# EAGLE design Arduino_S3v3_R2 (EAGLE 9.6.2)
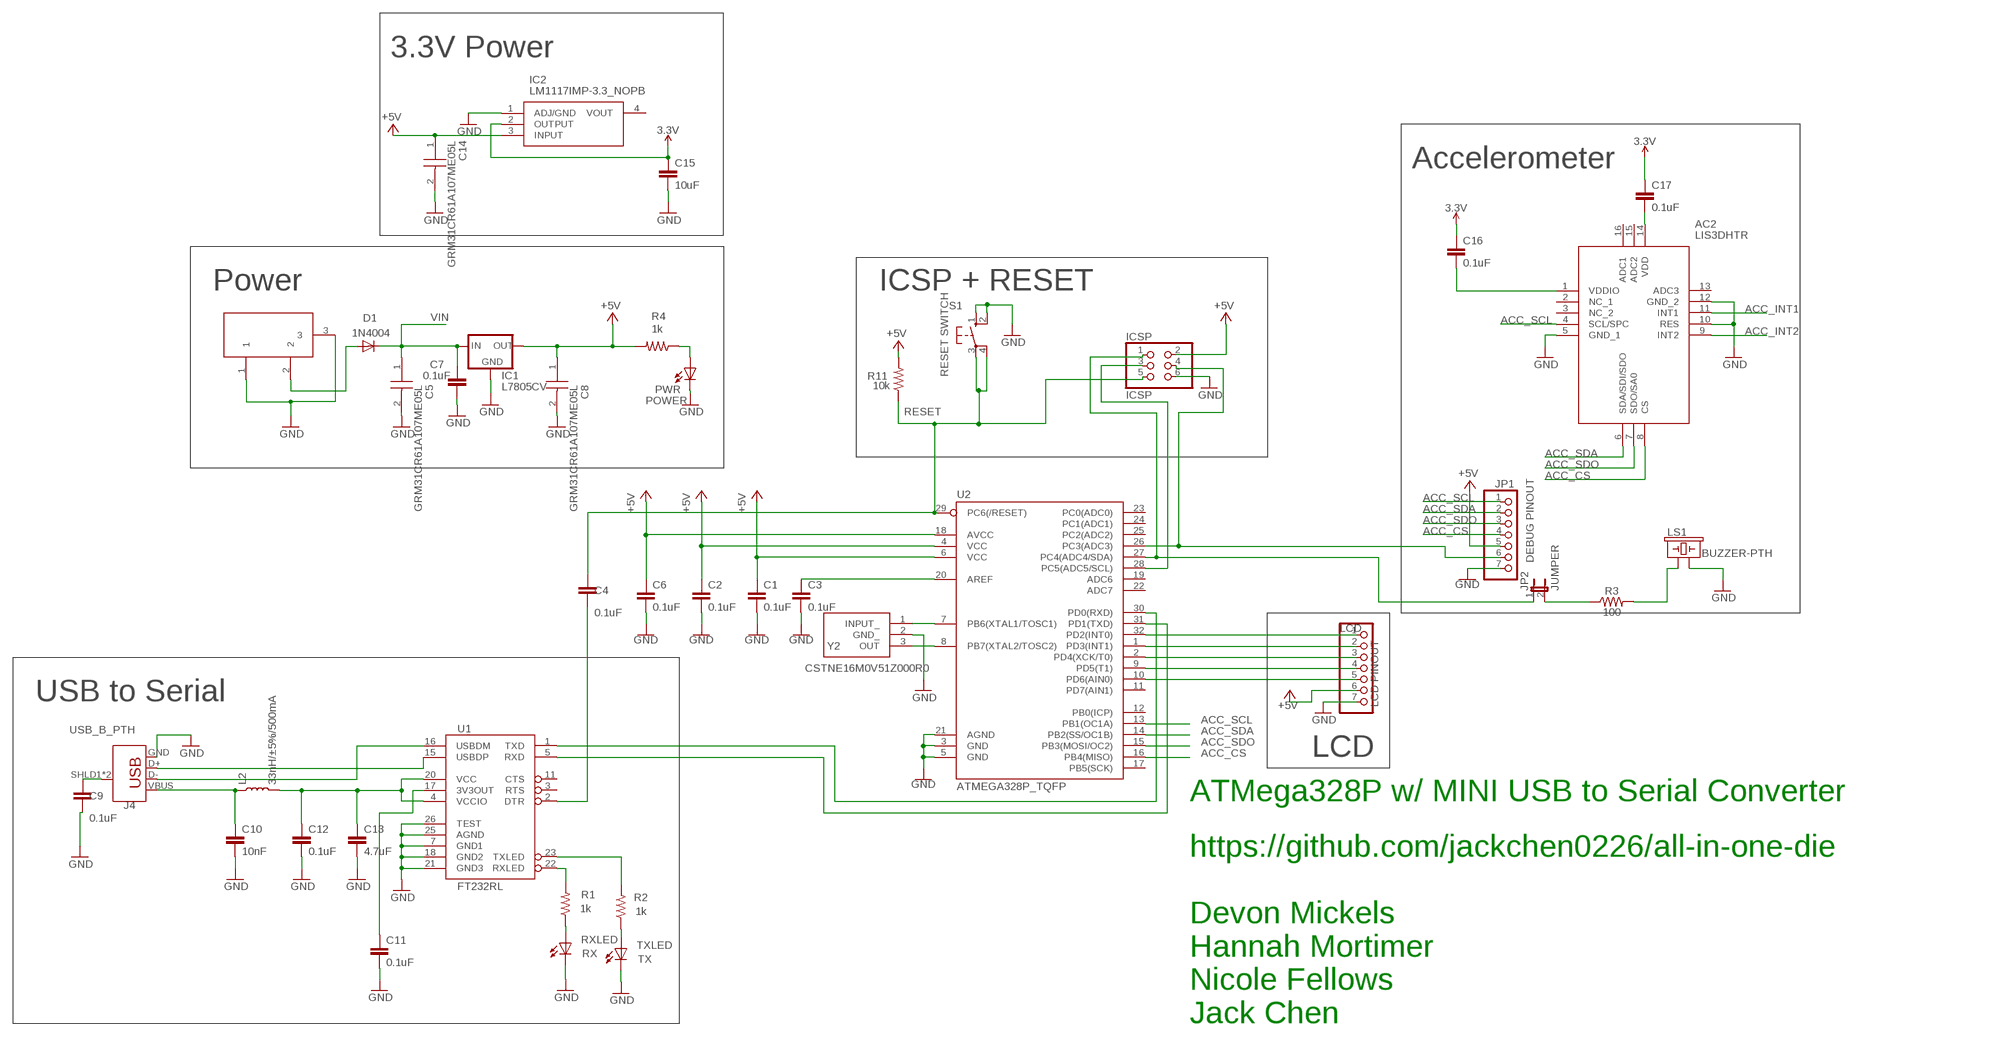
[diagram p0: schematic, sheet 1]

## Parts
AC2  LIS3DHTR  [LIS3DHTR]
C1  0.1uF  0.1UF-0603-25V-(+80/-20%)  [0603]
C2  0.1uF  0.1UF-0603-25V-(+80/-20%)  [0603]
C3  0.1uF  0.1UF-0603-25V-(+80/-20%)  [0603]
C4  0.1uF  0.1UF-0603-25V-(+80/-20%)  [0603]
C5  GRM31CR61A107ME05L  [CAPC3216X180N]
C6  0.1uF  0.1UF-0603-25V-(+80/-20%)  [0603]
C7  0.1uF  0.1UF-0603-25V-(+80/-20%)  [0603]
C8  GRM31CR61A107ME05L  [CAPC3216X180N]
C9  0.1uF  0.1UF-0603-25V-(+80/-20%)  [0603]
C10  10nF  10NF-0603-50V-10%  [0603]
C11  0.1uF  0.1UF-0603-25V-(+80/-20%)  [0603]
C12  0.1uF  0.1UF-0603-25V-(+80/-20%)  [0603]
C13  4.7uF  4.7UF0603  [0603]
C14  GRM31CR61A107ME05L  [CAPC3216X180N]
C15  10uF  10UF-0603-6.3V-20%  [0603]
C16  0.1uF  0.1UF-0603-25V-(+80/-20%)  [0603]
C17  0.1uF  0.1UF-0603-25V-(+80/-20%)  [0603]
D1  1N4004  [DO41-10]
DC1  DC21MMX  [DC-21MM]
IC1  L7805CV  78XXS  [78XXS]
IC2  LM1117IMP-3.3_NOPB  [SOT230P700X180-4N]
ICSP  ICSP  PINHD-2X3  [2X03]
J4  USB_B_PTH  [USB-B-PTH]
JP1  DEBUG PINOUT  PINHD-1X7  [1X07]
JP2  JUMPER  JP1E  [JP1]
L2  33nH/±5%/500mA  INDUCTOR-0603-33NH  [0603]
LCD  LCD PINOUT  PINHD-1X7  [1X07]
LS1  BUZZER-PTH  [BUZZER-12MM]
PWR  POWER  LED3MM  [LED3MM]
R1  1k  1KOHM-0603-1/10W-1%  [0603]
R2  1k  1KOHM-0603-1/10W-1%  [0603]
R3  100  100OHM-0603-1/4W-5%  [0603]
R4  1k  1KOHM-0603-1/10W-1%  [0603]
R11  10k  10KOHM-0603-1/10W-1%  [0603]
RXLED  RX  LED3MM  [LED3MM]
S1  RESET SWITCH  10-XX  [B3F-10XX]
TXLED  TX  LED3MM  [LED3MM]
U1  FT232RL  FT232RL-BASICSSOP  [SSOP28DB]
U2  ATMEGA328P_TQFP  [TQFP32-08]
Y2  CSTNE16M0V51Z000R0  [CSTNE16M0V51Z000R0]

## Nets
3.3V: C15.1 C16.1 C17.1 IC2.2(OUTPUT)
+5V [power]: C1.1 C2.1 C6.1 C8.1 C14.1 IC1.OUT IC2.3(INPUT) ICSP.2 JP1.5 LCD.6 R4.2 R11.2 U2.4(VCC) U2.6(VCC) U2.18(AVCC)
ACC_CS: AC2.8(CS) JP1.4 U2.16(PB4(MISO))
ACC_INT1: AC2.11(INT1)
ACC_INT2: AC2.9(INT2)
ACC_SCL: AC2.4(SCL/SPC) JP1.1 U2.13(PB1(OC1A))
ACC_SDA: AC2.6(SDA/SDI/SDO) JP1.2 U2.14(PB2(SS/OC1B))
ACC_SDO: AC2.7(SDO/SA0) JP1.3 U2.15(PB3(MOSI/OC2))
BUZZ: ICSP.1 JP2.1 U2.27(PC4(ADC4/SDA))
GND: AC2.5(GND_1) AC2.10(RES) AC2.12(GND_2) C1.2 C2.2 C3.2 C5.2 C6.2 C7.1 C8.2 C9.2 C10.2 C11.2 C12.2 C13.2 C14.2 C15.2 DC1.1 DC1.3 IC1.GND IC2.1(ADJ/GND) ICSP.6 J4.GND JP1.7 LCD.7 LS1.- PWR.K(C) RXLED.K(C) S1.1(S) S1.2(S1) TXLED.K(C) U1.7(GND1) U1.18(GND2) U1.21(GND3) U1.25(AGND) U1.26(TEST) U2.3(GND) U2.5(GND) U2.21(AGND) Y2.2(GND_)
LCD_CS: LCD.1 U2.32(PD2(INT0))
LCD_SCL: LCD.4 U2.9(PD5(T1))
LCD_SDA: LCD.3 U2.2(PD4(XCK/T0))
LCD_SDO: LCD.2 U2.1(PD3(INT1))
N$1: U2.7(PB6(XTAL1/TOSC1)) Y2.1(INPUT_)
N$2: C9.1 J4.SHLD1(SHIELD) J4.SHLD2(SHIELD)
N$3: PWR.A R4.1
N$4: C4.2 U1.2(DTR)
N$5: AC2.14(VDD) C17.2
N$6: U2.8(PB7(XTAL2/TOSC2)) Y2.3(OUT)
N$7: AC2.1(VDDIO) C16.2
N$8: D1.A DC1.2
N$9: J4.D+ U1.15(USBDP)
N$11: LCD.5 U2.10(PD6(AIN0))
N$12: JP2.2 R3.1
N$14: LS1.+ R3.2
N$15: ICSP.3 U2.28(PC5(ADC5/SCL))
N$16: C3.1 U2.20(AREF)
N$17: C11.1 U1.17(3V3OUT)
N$24: J4.D- U1.16(USBDM)
N$30: C10.1 J4.VBUS L2.1
N$32: R2.1 TXLED.A
N$33: R1.1 RXLED.A
POTIN: ICSP.4 JP1.6 U2.26(PC3(ADC3))
RESET: C4.1 ICSP.5 R11.1 S1.3(P) S1.4(P1) U2.29(PC6(/RESET))
RXD: U1.5(RXD) U2.31(PD1(TXD))
RXLED: R1.2 U1.22(RXLED)
TXD: U1.1(TXD) U2.30(PD0(RXD))
TXLED: R2.2 U1.23(TXLED)
VBUS: C12.1 C13.1 L2.2 U1.4(VCCIO) U1.20(VCC)
VIN [power]: C5.1 C7.2 D1.C IC1.IN
Unconnected: AC2.2(NC_1) AC2.3(NC_2) AC2.13(ADC3) AC2.15(ADC2) AC2.16(ADC1) IC2.4(VOUT) U1.3(RTS) U1.11(CTS) U2.11(PD7(AIN1)) U2.12(PB0(ICP)) U2.17(PB5(SCK)) U2.19(ADC6) U2.22(ADC7) U2.23(PC0(ADC0)) U2.24(PC1(ADC1)) U2.25(PC2(ADC2))

## Notes on the sheet
- 3.3V Power
- Accelerometer
- Power | ICSP + RESET
- USB to Serial
- LCD
- ATMega328P w/ MINI USB to Serial Converter
- https://github.com/jackchen0226/all-in-one-die
  
  Devon Mickels
  Hannah Mortimer
  Nicole Fellows
  Jack Chen

## Library data of the parts
AC2 = SamacSys_Parts:LIS3DHTR: Accelerometer 3-Axis 2g/16g 1.8V LGA16 STMicroelectronics LIS3DHTR Accelerometer IC, 3-axis, I2C, SPI 1.71 3.6 V, 16-Pin LGA Source: Datasheet <http://www.st.com/content/ccc/resource/technical/document/datasheet/3c/ae/50/85/d6/b1/46/fe/CD00274221.pdf/files/CD00274221.pdf/jcr:content/translations/en.CD00274221.pdf>; DESCRIPTION: Accelerometer 3-Axis 2g/16g 1.8V LGA16 STMicroelectronics LIS3DHTR Accelerometer IC, 3-axis, I2C, SPI 1.71 3.6 V, 16-Pin LGA; HEIGHT: 1mm; MANUFACTURER_NAME: STMicroelectronics; MANUFACTURER_PART_NUMBER: LIS3DHTR; MOUSER_PART_NUMBER: 511-LIS3DHTR; MOUSER_PRICE-STOCK: https://www.mouser.co.uk/ProductDetail/STMicroelectronics/LIS3DHTR?qs=6la6oa3D8xzhXYax3cEo4w%3D%3D
C1-C4 C6 C7 C9 C11 C12 C16 C17 = SparkFun-Capacitors:0.1UF: 0.1µF ceramic capacitors A capacitor is a passive two-terminal electrical component used to store electrical energy temporarily in an electric field.; MFR: KEMET; MPN: C0603X104K5RAC3316; PROD_ID: CAP-00810
C5 C8 C14 = SamacSys_Parts:GRM31CR61A107ME05L: Multilayer Ceramic Capacitors MLCC - SMD/SMT 100UF 10V 20% 1206 Source: Datasheet <https://psearch.en.murata.com/capacitor/product/GRM31CR61A107ME05#.html>; DESCRIPTION: Multilayer Ceramic Capacitors MLCC - SMD/SMT 100UF 10V 20% 1206; HEIGHT: 1.8mm; MANUFACTURER_NAME: Murata Electronics; MANUFACTURER_PART_NUMBER: GRM31CR61A107ME05L; MOUSER_PART_NUMBER: 81-GRM31CR61A107ME5L; MOUSER_PRICE-STOCK: https://www.mouser.co.uk/ProductDetail/Murata-Electronics/GRM31CR61A107ME05L?qs=chTDxNqvsylSo93CzdbYkQ%3D%3D
C10 = SparkFun-Capacitors:10NF: 0.01uF/10nF/10,000pF ceramic capacitors A capacitor is a passive two-terminal electrical component used to store electrical energy temporarily in an electric field. CAP-09321; MFR: KEMET; MPN: C0603C103K5RAC7013; PROD_ID: CAP-00867
C13 = SparkFun-Capacitors:4.7UF: 4.7µF ceramic capacitors A capacitor is a passive two-terminal electrical component used to store electrical energy temporarily in an electric field.; MFR: Taiyo Yuden; MPN: LMK107BJ475MAHT; PROD_ID: CAP-08280
C15 = SparkFun-Capacitors:10UF: 10.0µF ceramic capacitors A capacitor is a passive two-terminal electrical component used to store electrical energy temporarily in an electric field.; MFR: Murata Electronics; MOUSER_URL: https://www.mouser.com/ProductDetail/Murata-Electronics/GRM188R61E106KA73D?qs=sGAEpiMZZMsh%252B1woXyUXj%252BPOAS4JE4Y%252Bzpwpuo4MIOw%3D; MPN: GRM188R61E106KA73D; PROD_ID: CAP-11015
D1 = diode:1N4004: DIODE general purpose rectifier, 1 A; MFR: Diodes Incorporated; MPN: 1N4004-T
DC1 = powersupply:DC21MM; MFR: Gravitech; MPN: CON-SOCJ-2155
IC1 = v-reg:78XXS: VOLTAGE REGULATOR; MFR: STMicroelectronics; MPN: L7805CV
IC2 = SamacSys_Parts:LM1117IMP-3.3_NOPB: LM1117IMP-3.3/NOPB, Low Dropout Voltage Regulator, 1.5A, 3.3 V +/-1%, 4-Pin SOT-223 Source: Datasheet <http://www.ti.com/general/docs/suppproductinfo.tsp?distId=10&gotoUrl=http://www.ti.com/lit/gpn/lm1117>; DESCRIPTION: LM1117IMP-3.3/NOPB, Low Dropout Voltage Regulator, 1.5A, 3.3 V +/-1%, 4-Pin SOT-223; HEIGHT: 1.8mm; MANUFACTURER_NAME: Texas Instruments; MANUFACTURER_PART_NUMBER: LM1117IMP-3.3/NOPB; MOUSER_PART_NUMBER: 926-LM1117IMP3.3NOPB; MOUSER_PRICE-STOCK: https://www.mouser.co.uk/ProductDetail/Texas-Instruments/LM1117IMP-33-NOPB?qs=X1J7HmVL2ZFbpN1TgOsjYQ%3D%3D
ICSP = pinhead:PINHD-2X3: PIN HEADER; MFR: Harwin; MOUSER_URL: https://www.mouser.com/ProductDetail/Harwin/M20-9980346?qs=%2Fha2pyFadugpDTU623Z7cOn94IPgrKYxpsSsFXjhjuIUvhMLOEYbRg%3D%3D; MPN: M20-9980346
J4 = SparkFun-Connectors:USB_B: USB Type B Connector SparkFun Products: SparkFun Stepoko <https://www.sparkfun.com/products/13899> PTH; MFR: Amphenol FCI; MPN: 61729-0010BLF; PROD_ID: CONN-08278; SF_ID: PRT-00139
JP1 LCD = pinhead:PINHD-1X7: PIN HEADER; MFR: Harwin; MOUSER_URL: https://www.mouser.com/ProductDetail/Harwin/M20-9770746?qs=Jph8NoUxIfW4IDi91nhySw%3D%3D; MPN: M20-9770746
JP2 = jumper:JP1E: JUMPER; MFR: Harwin; MOUSER_URL: https://www.mouser.com/ProductDetail/Harwin/M20-9990246?qs=%2Fha2pyFaduiXJxN7aDGirbxqdyhVq5pmtKpTydx04Ewn6SNnO8w53Q%3D%3D; MPN: M20-9990246
L2 = SparkFun-Coils:INDUCTOR: Inductors Resist changes in electrical current. Basically a coil of wire. SparkFun Products: SparkFun Load Cell Amplifier - HX711 <https://www.sparkfun.com/products/13879> IOIO-OTG - V2.2 <https://www.sparkfun.com/products/13613>; MFR: Murata Electronics; MPN: LQW18AS33NJ0CD; PROD_ID: NDUC-07874
LS1 = SparkFun-Electromechanical:BUZZER: Buzzer Small round buzzers that operate around the audible 2kHz range. You can use these as speakers to create simple music or user interfaces. Variant Overview: PTH - Mini Speaker - PC Mount 12mm 2.048kHz <https://www.sparkfun.com/products/7950> PTH_KIT - Mini Speaker - PC Mount 12mm 2.048kHz <https://www.sparkfun.com/products/7950> KIT simplifies soldering by adding stop mask to one side of the pads. PTH_NO_SILK - Mini Speaker - PC Mount 12mm 2.048kHz <https://www.sparkfun.com/products/7950> No silkscreen indicator of buzzer outline. PTH_KIT_NO_SILK - Mini Speaker - PC Mount 12mm 2.048kHz <https://www.sparkfun.com/products/7950> KIT package w/o silkscreen SMD - Buzzer Audio Magnetic (CCV-084B16) SMD buzzer used on, e.g. the LilyPad Buzzer <https://www.sparkfun.com/products/8463> and RFID USB Reader <https://www.sparkfun.com/products/9963>. SMD_KIT - Buzzer Audio Magnetic (CCV-084B16) SMD Buzzer with elongated pins to make soldering easier. Used on the SparkFun Simon Says - Surface Mount Soldering Kit <https://www.sparkfun.com/products/10935>.; MFR: TDK; MPN: SD1209T5-A1; PROD_ID: COMP-08253; SF_SKU: COM-07950
PWR = led:LED: LED OSRAM: - CHIPLED LG R971, LG N971, LY N971, LG Q971, LY Q971, LO R971, LY R971 LH N974, LH R974 LS Q976, LO Q976, LY Q976 LO Q996 - Hyper CHIPLED LW Q18S LB Q993, LB Q99A, LB R99A - SideLED LS A670, LO A670, LY A670, LG A670, LP A670 LB A673, LV A673, LT A673, LW A673 LH A674 LY A675 LS A676, LA A676, LO A676, LY A676, LW A676 LS A679, LY A679, LG A679 - Hyper Micro SIDELED® LS Y876, LA Y876, LO Y876, LY Y876 LT Y87S - SmartLED LW L88C, LW L88S LB L89C, LB L89S, LG L890 LS L89K, LO L89K, LY L89K LS L896, LA L896, LO L896, LY L896 - TOPLED LS T670, LO T670, LY T670, LG T670, LP T670 LSG T670, LSP T670, LSY T670, LOP T670, LYG T670 LG T671, LOG T671, LSG T671 LB T673, LV T673, LT T673, LW T673 LH T674 LS T676, LA T676, LO T676, LY T676, LB T676, LH T676, LSB T676, LW T676 LB T67C, LV T67C, LT T67C, LS T67K, LO T67K, LY T67K, LW E67C LS E67B, LA E67B, LO E67B, LY E67B, LB E67C, LV E67C, LT E67C LW T67C LS T679, LY T679, LG T679 LS T770, LO T770, LY T770, LG T770, LP T770 LB T773, LV T773, LT T773, LW T773 LH T774 LS E675, LA E675, LY E675, LS T675 LS T776, LA T776, LO T776, LY T776, LB T776 LHGB T686 LT T68C, LB T68C - Hyper Mini TOPLED® LB M676 - Mini TOPLED Santana® LG M470 LS M47K, LO M47K, LY M47K Source: http://www.osram.convergy.de/; MFR: VCC; MPN: LTH3MM12VFR4100
R1 R2 R4 = SparkFun-Resistors:1KOHM: 1kΩ resistor A resistor is a passive two-terminal electrical component that implements electrical resistance as a circuit element. Resistors act to reduce current flow, and, at the same time, act to lower voltage levels within circuits. - Wikipedia; MFR: Vishay / Dale; MPN: RCC06031K00FKEA; PROD_ID: RES-07856
R3 = SparkFun-Resistors:100OHM: 100Ω resistor A resistor is a passive two-terminal electrical component that implements electrical resistance as a circuit element. Resistors act to reduce current flow, and, at the same time, act to lower voltage levels within circuits. - Wikipedia; MFR: Vishay / Dale; MOUSER_URL: https://www.mouser.com/ProductDetail/Vishay-Dale/RCC0603100RFKEA?qs=sGAEpiMZZMtlubZbdhIBINZyO39%252BOXIfMh0DS6XcVj8%3D; MPN: RCC0603100RFKEA; PROD_ID: RES-12438
R11 = SparkFun-Resistors:10KOHM: 10kΩ resistor A resistor is a passive two-terminal electrical component that implements electrical resistance as a circuit element. Resistors act to reduce current flow, and, at the same time, act to lower voltage levels within circuits. - Wikipedia; MFR: Panasonic; MPN: ERJ-UP3D1002V; PROD_ID: RES-00824
RXLED TXLED = led:LED: LED OSRAM: - CHIPLED LG R971, LG N971, LY N971, LG Q971, LY Q971, LO R971, LY R971 LH N974, LH R974 LS Q976, LO Q976, LY Q976 LO Q996 - Hyper CHIPLED LW Q18S LB Q993, LB Q99A, LB R99A - SideLED LS A670, LO A670, LY A670, LG A670, LP A670 LB A673, LV A673, LT A673, LW A673 LH A674 LY A675 LS A676, LA A676, LO A676, LY A676, LW A676 LS A679, LY A679, LG A679 - Hyper Micro SIDELED® LS Y876, LA Y876, LO Y876, LY Y876 LT Y87S - SmartLED LW L88C, LW L88S LB L89C, LB L89S, LG L890 LS L89K, LO L89K, LY L89K LS L896, LA L896, LO L896, LY L896 - TOPLED LS T670, LO T670, LY T670, LG T670, LP T670 LSG T670, LSP T670, LSY T670, LOP T670, LYG T670 LG T671, LOG T671, LSG T671 LB T673, LV T673, LT T673, LW T673 LH T674 LS T676, LA T676, LO T676, LY T676, LB T676, LH T676, LSB T676, LW T676 LB T67C, LV T67C, LT T67C, LS T67K, LO T67K, LY T67K, LW E67C LS E67B, LA E67B, LO E67B, LY E67B, LB E67C, LV E67C, LT E67C LW T67C LS T679, LY T679, LG T679 LS T770, LO T770, LY T770, LG T770, LP T770 LB T773, LV T773, LT T773, LW T773 LH T774 LS E675, LA E675, LY E675, LS T675 LS T776, LA T776, LO T776, LY T776, LB T776 LHGB T686 LT T68C, LB T68C - Hyper Mini TOPLED® LB M676 - Mini TOPLED Santana® LG M470 LS M47K, LO M47K, LY M47K Source: http://www.osram.convergy.de/; MFR: VCC; MPN: LTH3MM12VFR4500
S1 = switch-omron:10-XX: OMRON SWITCH; MFR: Omron Electronics; MPN: B3F-1000
U1 = SparkFun-IC-Comms:FT232RL-BASIC: FT232RL USB UART This is the simplified version of the FT232RL unit. Only what you need, nothing you don't. FT232RL 4th Generation USB UART (USB <-> Serial) Controller. Datasheet <http://www.sparkfun.com/datasheets/IC/FT232R_v104.pdf> SparkFun Products Component <https://www.sparkfun.com/products/650> (COM-00650) SparkFun RedBot Mainboard <https://www.sparkfun.com/products/12097> (ROB-12097) SparkFun FTDI Basic Breakout - 5V <https://www.sparkfun.com/products/9716> (DEV-09716) SparkFun FTDI Basic Breakout - 3.3V <https://www.sparkfun.com/products/9873> (DEV-09873) Bus Pirate - v3.6a <https://www.sparkfun.com/products/12942> (TOL-12942) SparkFun USB to Serial Breakout - FT232RL <https://www.sparkfun.com/products/12731> (BOB-12731) SparkFun PicoBoard <https://www.sparkfun.com/products/11888> (WIG-11888) SparkFun RFID USB Reader <https://www.sparkfun.com/products/9963> (SEN-09963) LilyPad FTDI Basic Breakout - 5V <https://www.sparkfun.com/products/10275> (DEV-10275) SparkFun Stepoko <https://www.sparkfun.com/products/13899> (ROB-13899); MFR: FTDI; MPN: FT232RL-REEL; PROD_ID: IC-00870
U2 = SparkFun-IC-Microcontroller:ATMEGA328P_TQFP: Popular 328P in QFP Storefront component: ATmega328 - TQFP <https://www.sparkfun.com/products/13448> (COM-13448) Datasheet <http://www.sparkfun.com/datasheets/Components/SMD/ATMega328.pdf> SparkFun Products SparkFun RedBoard - Programmed with Arduino <https://www.sparkfun.com/products/12757> (DEV-12757) Arduino Pro Mini 328 - 5V/16MHz <https://www.sparkfun.com/products/11113> (DEV-11113) Arduino Pro Mini 328 - 3.3V/8MHz <https://www.sparkfun.com/products/11114> (DEV-11114) SparkFun OpenLog <https://www.sparkfun.com/products/13712> (DEV-13712) SparkFun MicroView - OLED Arduino Module <https://www.sparkfun.com/products/12923> (DEV-12923) SparkFun Digital Sandbox <https://www.sparkfun.com/products/12651> (DEV-12651) SparkFun PicoBoard <https://www.sparkfun.com/products/11888> (WIG-11888) Arduino Fio <https://www.sparkfun.com/products/10116> (DEV-10116) LilyPad Arduino 328 Main Board <https://www.sparkfun.com/products/13342> (DEV-13342) SparkFun RedStick <https://www.sparkfun.com/products/13741> (DEV-13741) LilyPad MP3 <https://www.sparkfun.com/products/11013> (DEV-11013) LilyPad Arduino SimpleSnap <https://www.sparkfun.com/products/10941> (DEV-10941) SparkFun Stepoko <https://www.sparkfun.com/products/13899> (ROB-13899) SparkFun Geiger Counter <https://www.sparkfun.com/products/11345> (SEN-11345) SparkFun EL Sequencer <https://www.sparkfun.com/products/12781> (COM-12781) Arduino Pro 328 - 5V/16MHz <https://www.sparkfun.com/products/10915> (DEV-10915) CryptoCape <https://www.sparkfun.com/products/12773> (DEV-12773) SparkFun IR Thermometer Evaluation Board - MLX90614 <https://www.sparkfun.com/products/10740> (SEN-10740) SparkFun RedBot Mainboard <https://www.sparkfun.com/products/12097> (ROB-12097) Arduino Pro 328 - 3.3V/8MHz <https://www.sparkfun.com/products/10914> (DEV-10914) SparkFun Block for Intel® Edison - Arduino <https://www.sparkfun.com/products/13036> (DEV-13036) SparkFun Simon Says - Surface Mount Soldering Kit <https://www.sparkfun.com/products/10935> (KIT-10935) SparkFun 7-Segment Serial Display - Red <https://www.sparkfun.com/products/11441> (COM-11441) SparkFun 7-Segment Serial Display - White <https://www.sparkfun.com/products/11629> (COM-11629) SparkFun 7-Segment Serial Display - Yellow <https://www.sparkfun.com/products/11443> (COM-11443) SparkFun 7-Segment Serial Display - Kelly Green <https://www.sparkfun.com/products/11440> (COM-11440) SparkFun 7-Segment Serial Display - Blue <https://www.sparkfun.com/products/11442> (COM-11442) SparkFun OpenSegment Serial Display - 20mm (Blue) <https://www.sparkfun.com/products/11647> (COM-11647) SparkFun OpenSegment Serial Display - 20mm (Green) <https://www.sparkfun.com/products/11646> (COM-11646) SparkFun OpenSegment Serial Display - 20mm (White) <https://www.sparkfun.com/products/11648> (COM-11648) SparkFun OpenSegment Serial Display - 20mm (Red) <https://www.sparkfun.com/products/11644> (COM-11644) SparkFun OpenSegment Serial Display - 20mm (Yellow) <https://www.sparkfun.com/products/11645> (COM-11645) SparkFun OpenSegment Shield <https://www.sparkfun.com/products/13190> (DEV-13190); MFR: Microchip Technology / Atmel; MPN: ATMEGA328P-AU; PROD_ID: IC-09069
Y2 = SamacSys_Parts:CSTNE16M0V51Z000R0: Resonators 16.0MHz 5pF 0.5% Cer Res Thk Exp mode Source: Datasheet <https://componentsearchengine.com/Datasheets/1/CSTNE16M0V51Z000R0.pdf>; DESCRIPTION: Resonators 16.0MHz 5pF 0.5% Cer Res Thk Exp mode; HEIGHT: 1mm; MANUFACTURER_NAME: Murata Electronics; MANUFACTURER_PART_NUMBER: CSTNE16M0V51Z000R0; MOUSER_PART_NUMBER: 81-CSTNE16M0V51Z000R; MOUSER_PRICE-STOCK: https://www.mouser.co.uk/ProductDetail/Murata-Electronics/CSTNE16M0V51Z000R0?qs=xZ%2FP%252Ba9zWqYJTgLasPOhOA%3D%3D

## Net classes
1 power: width 0.61 mm

## Board
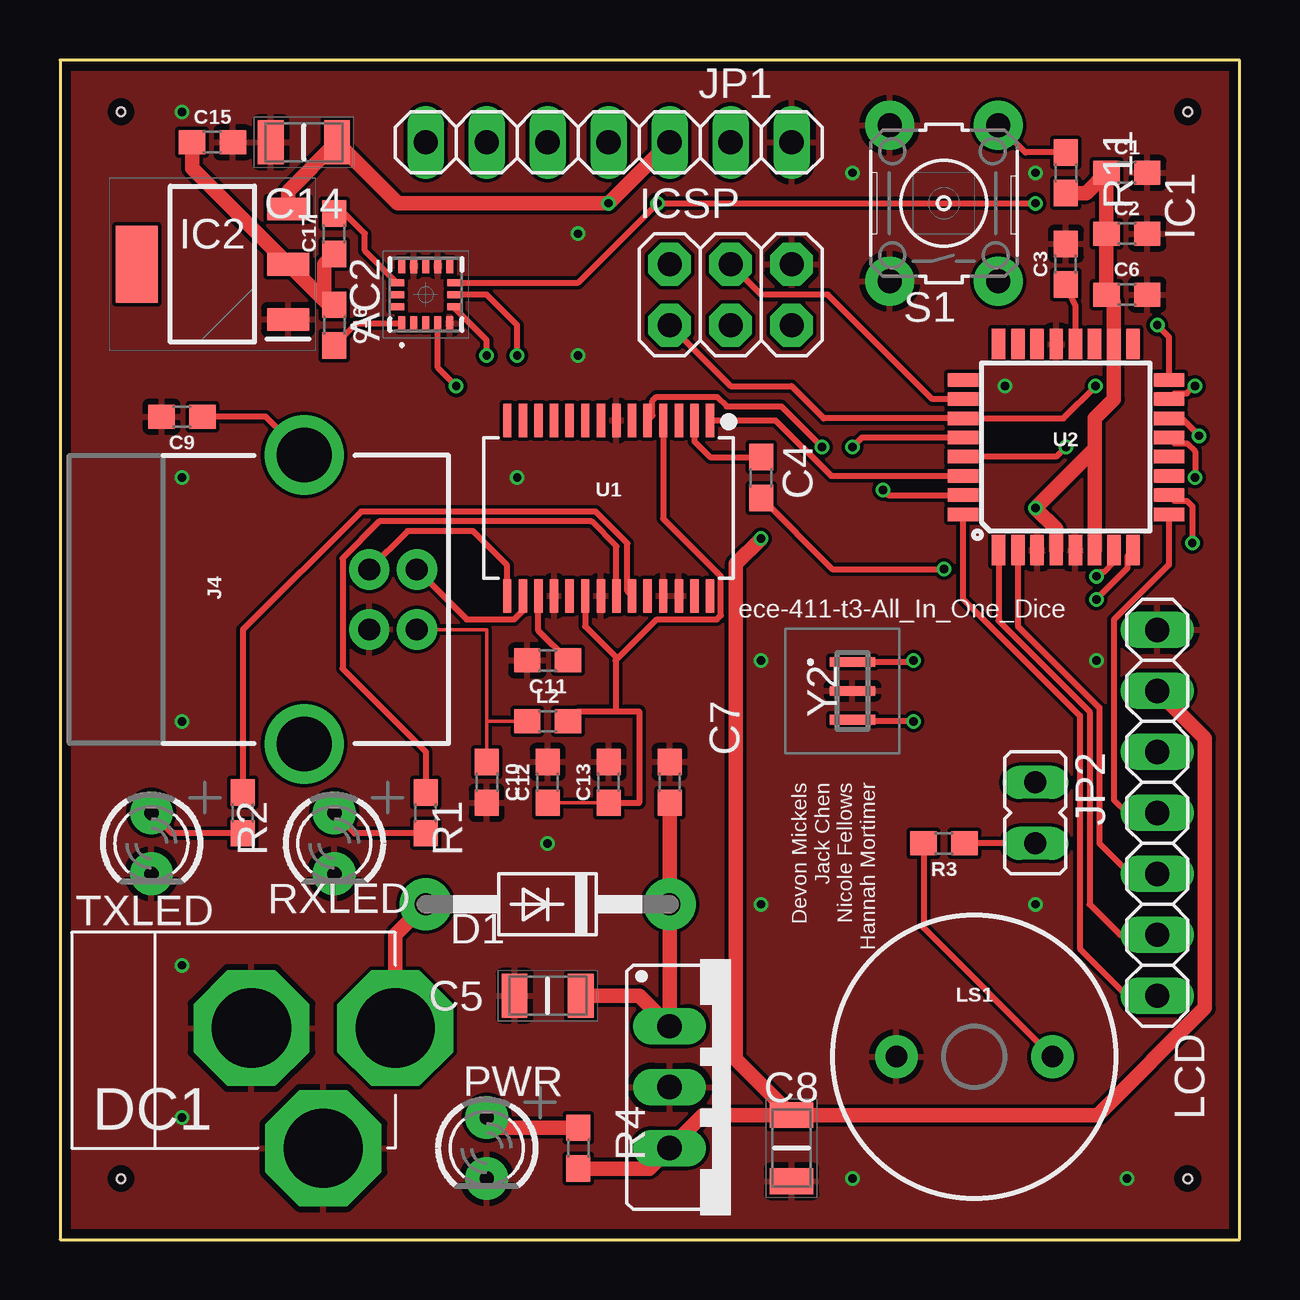
[diagram p1: board, top side]
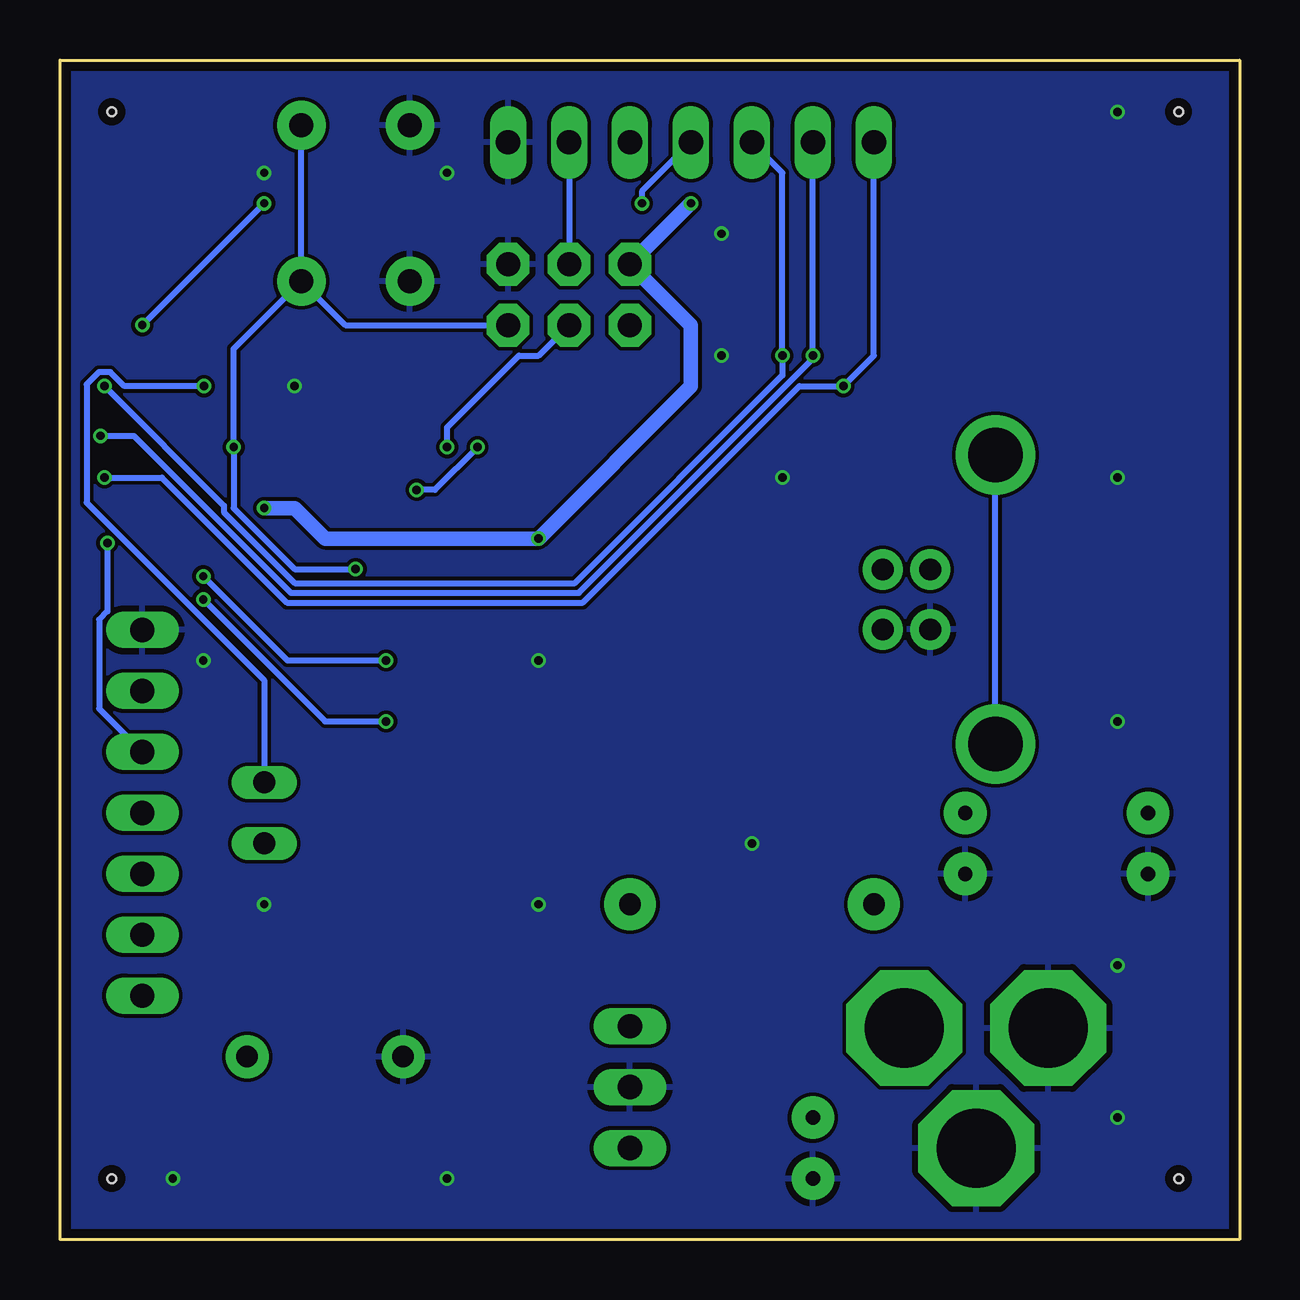
[diagram p2: board, bottom side, seen from below]

Size 49.15 x 49.15 mm. Coordinates in mm from the lower left corner, seen from the top.
Outline: 0,49.15 0,0 49.15,0 49.15,49.15 0,49.15
Copper layers (1*16): Top 0.035559375mm / dielectric 1.6mm / Bottom 0.035559375mm
Design rules "oshpark-2layer": minimum track width 6mil, minimum drill 10mil, track to track 6mil, track to pad 6mil, pad to pad 6mil, via to via 6mil, smd to smd 6mil, copper to edge 15mil, drill to drill 6mil, minimum pad ring 5mil, minimum via ring 5mil, stop-mask expansion 2.5mil, vias tented up to drill 0mil, thermal gap 10mil
Holes 0.35 mm at 2.54,2.54 2.54,46.99 46.99,46.99 46.99,2.54

### Footprints (pad centres in the part's own frame; a part is rotated, then mirrored left to right if it is on the bottom)
LIS3DHTR = smd 0.6 x 0.3: 1 -1.2,1; 2 -1.2,0.5; 3 -1.2,0; 4 -1.2,-0.5; 5 -1.2,-1; 9 1.2,-1; 10 1.2,-0.5; 11 1.2,0; 12 1.2,0.5; 13 1.2,1 | smd 0.3 x 0.6: 6 -0.5,-1.2; 7 0,-1.2; 8 0.5,-1.2; 14 0.5,1.2; 15 0,1.2; 16 -0.5,1.2
0603 = smd 1.1 x 1: 1 -0.85,0; 2 0.85,0
CAPC3216X180N = smd 1.07 x 1.82: 1 -1.38,0; 2 1.38,0
DO41-10 = drill 0.9 pad 2.159: A 5.08,0; C -5.08,0
DC-21MM = drill 3.302 pad 4.826 octagon: 1 -5.08,-3.353; 2 -0.076,-6.35; 3 -0.076,-0.356
78XXS = drill 1.016 long: GND 0,-2.54; IN -2.54,-2.54; OUT 2.54,-2.54
SOT230P700X180-4N = smd 1.75 x 0.95: 1 -3.15,2.3; 2 -3.15,0; 3 -3.15,-2.3 | smd 1.75 x 3.2: 4 3.15,0
2X03 = drill 1 pad 1.778 octagon: 1 -2.54,-1.27; 2 -2.54,1.27; 3 0,-1.27; 4 0,1.27; 5 2.54,-1.27; 6 2.54,1.27
USB-B-PTH = drill 0.914 pad 1.676: D+ 4,1.25; D- 5.981,1.25; GND 4,-1.25; VBUS 5.981,-1.25 | drill 2.286: SHLD1 1.282,-6.02; SHLD2 1.282,6.02
1X07 = drill 1.016 long: 1 -7.62,0; 2 -5.08,0; 3 -2.54,0; 4 0,0; 5 2.54,0; 6 5.08,0; 7 7.62,0
JP1 = drill 0.914 long: 1 0,-1.27; 2 0,1.27
BUZZER-12MM = drill 0.9 pad 1.778: + 3.25,0; - -3.25,0
LED3MM = drill 0.6 pad 1.778: A -1.27,0; K 1.27,0
B3F-10XX = drill 1 pad 2.032: 1 -3.251,2.261; 2 3.251,2.261; 3 -3.251,-2.261; 4 3.251,-2.261
SSOP28DB = smd 0.348 x 1.397: 1 -4.225,-3.656; 2 -3.575,-3.656; 3 -2.925,-3.656; 4 -2.275,-3.656; 5 -1.625,-3.656; 6 -0.975,-3.656; 7 -0.325,-3.656; 8 0.325,-3.656; 9 0.975,-3.656; 10 1.625,-3.656; 11 2.275,-3.656; 12 2.925,-3.656; 13 3.575,-3.656; 14 4.225,-3.656; 15 4.225,3.656; 16 3.575,3.656; 17 2.925,3.656; 18 2.275,3.656; 19 1.625,3.656; 20 0.975,3.656; 21 0.325,3.656; 22 -0.325,3.656; 23 -0.975,3.656; 24 -1.625,3.656; 25 -2.275,3.656; 26 -2.925,3.656; 27 -3.575,3.656; 28 -4.225,3.656
TQFP32-08 = smd 1.27 x 0.559: 1 -4.293,2.8; 2 -4.293,2; 3 -4.293,1.2; 4 -4.293,0.4; 5 -4.293,-0.4; 6 -4.293,-1.2; 7 -4.293,-2; 8 -4.293,-2.8; 17 4.293,-2.8; 18 4.293,-2; 19 4.293,-1.2; 20 4.293,-0.4; 21 4.293,0.4; 22 4.293,1.2; 23 4.293,2; 24 4.293,2.8 | smd 0.559 x 1.27: 9 -2.8,-4.293; 10 -2,-4.293; 11 -1.2,-4.293; 12 -0.4,-4.293; 13 0.4,-4.293; 14 1.2,-4.293; 15 2,-4.293; 16 2.8,-4.293; 25 2.8,4.293; 26 2,4.293; 27 1.2,4.293; 28 0.4,4.293; 29 -0.4,4.293; 30 -1.2,4.293; 31 -2,4.293; 32 -2.8,4.293
CSTNE16M0V51Z000R0 = smd 0.4 x 1.9: 1 1.2,0; 2 0,0; 3 -1.2,0

### Placement (x,y rotation side)
AC2  15.24,39.37 90 top
C1  44.45,44.45 0 top
C2  44.45,41.91 0 top
C3  41.91,40.64 90 top
C4  29.21,31.75 90 top
C5  20.32,10.16 180 top
C6  44.45,39.37 0 top
C7  25.4,19.05 270 top
C8  30.48,3.81 270 top
C9  5.08,34.29 180 top
C10  17.78,19.05 270 top
C11  20.32,24.13 180 top
C12  20.32,19.05 90 top
C13  22.86,19.05 90 top
C14  10.16,45.72 180 top
C15  6.35,45.72 0 top
C16  11.43,38.1 270 top
C17  11.43,41.91 90 top
D1  20.32,13.97 180 top
DC1  7.62,8.89 90 top
IC1  27.94,6.35 270 top
IC2  6.35,40.64 180 top
ICSP  27.94,39.37 0 top
J4  8.89,26.67 0 top
JP1  22.86,45.72 0 top
JP2  40.64,17.78 180 top
L2  20.32,21.59 0 top
LCD  45.72,17.78 90 top
LS1  38.1,7.62 0 top
PWR  17.78,3.81 270 top
R1  15.24,17.78 90 top
R2  7.62,17.78 90 top
R3  36.83,16.51 180 top
R4  21.59,3.81 270 top
R11  41.91,44.45 270 top
RXLED  11.43,16.51 270 top
S1  36.83,43.18 90 top
TXLED  3.81,16.51 270 top
U1  22.86,30.48 180 top
U2  41.91,33.02 90 top
Y2  33.02,22.86 90 top

### Tracks (layer width: path | path; a pad name or v marks a point on that pad's centre or on a via)
3.3V
  Top 0.61: 11.01,39.13 IC2.2 5.5,44.64 C15.1 | C16.1 11.19,38.95 11.01,39.13 | C17.1 11.01,40.64 11.01,39.13
+5V  (via drill 0.35)
  Top 0.61: U2.6 43.11,32.95 | 43.11,32.95 43.11,34.22 43.91,35.02 U2.18 43.91,39.06 C6.1 C2.1 C1.1 42.75,43.6 R11.2 | v29.21,29.21 28.16,28.16 28.16,7.51 C8.1 | LCD.6 47.7,20.88 47.7,9.65 43.24,5.19 C8.1 | IC2.3 9.5,43.68 C14.1 14.08,43.18 v22.86,43.18 JP1.5 | R4.2 24.55,2.96 IC1.OUT 26.78,5.19 C8.1 | U2.4 41.51,29.61 v40.64,30.48 43.11,32.95
  Bottom 0.61: v40.64,30.48 39.37,30.48 38.1,29.21 v29.21,29.21 22.86,35.56 22.86,38.1 ICSP.2 v22.86,43.18
ACC_CS  (via drill 0.35)
  Top 0.254: AC2.8 21.59,39.87 v24.9,43.18 v40.64,43.18 | v45.72,38.1 46.2,37.62 U2.16
  Bottom 0.254: v40.64,43.18 v45.72,38.1 | JP1.4 24.9,43.68 v24.9,43.18
ACC_SCL  (via drill 0.35)
  Top 0.254: U2.13 46.44,33.18 46.95,33.18 47.29,32.84 v47.29,31.75 | v16.51,35.56 15.74,36.33 AC2.4
  Bottom 0.254: v47.29,31.75 44.9,31.75 39.7,26.54 27.36,26.54 18.34,35.56 v16.51,35.56 15.24,36.83 JP1.1
ACC_SDA  (via drill 0.35)
  Top 0.254: U2.14 46.73,34.22 v47.46,33.49 | v17.78,36.83 17.78,37.48 16.44,38.81 AC2.6
  Bottom 0.254: v47.46,33.49 46.07,33.49 39.53,26.95 27.53,26.95 17.78,36.7 v17.78,36.83 JP1.2
ACC_SDO  (via drill 0.35)
  Top 0.254: U2.15 46.44,35.26 46.95,35.26 47.25,35.56 v47.29,35.56 | v19.05,36.83 19.05,38.1 17.78,39.37 AC2.7
  Bottom 0.254: v47.29,35.56 42.32,30.58 42.32,30.31 39.36,27.36 27.7,27.36 19.05,36 v19.05,36.83 19.05,44.45 JP1.3
BUZZ  (via drill 0.35)
  Top 0.254: ICSP.1 27.94,35.56 30.48,35.56 31.82,34.22 U2.27 41.81,34.22 v43.15,35.56
  Bottom 0.254: v43.15,35.56 46.47,35.56 47.05,36.14 47.53,36.14 48.04,35.63 48.04,30.71 40.64,23.31 JP2.1
GND  (via drill 0.35)
  other vias: 5.08,46.99 5.08,31.75 5.08,21.59 5.08,11.43 5.08,5.08 29.21,13.97 33.02,2.54 40.64,13.97 29.21,24.13 21.59,41.91 21.59,36.83 39.37,35.56 43.18,24.13 44.45,2.54 40.64,44.45 33.02,44.45 20.32,16.51 19.05,31.75
  pour Top: 0,49.15 0,0 49.15,0 49.15,49.15
  pour Bottom: 0,49.15 49.15,49.15 49.15,0 0,0
LCD_CS
  Top 0.254: U2.32 37.62,26.7 42.49,21.83 42.49,12.12 44.45,10.16 LCD.1
LCD_SCL
  Top 0.254: U2.9 46.2,28.12 43.92,25.83 43.92,18.31 44.45,17.78 LCD.4
LCD_SDA
  Top 0.254: U2.2 39.91,25.56 43.3,22.17 43.3,16.51 44.57,15.24 LCD.3
LCD_SDO
  Top 0.254: U2.1 39.11,25.79 42.9,22 42.9,13.97 44.17,12.7 LCD.2
N$1  (via drill 0.35)
  Top 0.254: v43.18,27.64 43.35,27.81 43.51,27.81 43.91,28.22 U2.7 | v35.56,24.13 35.49,24.06 Y2.1
  Bottom 0.254: v43.18,27.64 39.67,24.13 v35.56,24.13
N$2
  Top 0.254: J4.SHLD2 8.57,34.29 C9.1
  Bottom 0.254: J4.SHLD1 J4.SHLD2
N$3
  Top 0.61: R4.1 18.2,4.66 PWR.A
N$4
  Top 0.254: U1.2 26.43,33.26 27.09,32.6 C4.2
N$5
  Top 0.254: AC2.14 12.7,41.21 12.7,41.91 11.85,42.76 C17.2
N$6  (via drill 0.35)
  Top 0.254: U2.8 44.47,28.49 44.47,27.98 43.18,26.69 v43.18,26.67 | v35.56,21.59 33.09,21.59 Y2.3
  Bottom 0.254: v43.18,26.67 38.1,21.59 v35.56,21.59
N$7
  Top 0.254: C16.2 12.35,38.17 AC2.1
N$8
  Top 0.61: D1.A 13.97,12.7 DC1.2
N$9
  Top 0.254: U1.15 18.64,28.09 17.21,29.52 14.48,29.52 J4.D+
N$11  (via drill 0.35)
  Top 0.254: U2.10 46.44,30.78 46.95,30.78 47.18,30.55 v47.18,29.02
  Bottom 0.254: v47.18,29.02 47.18,26.18 47.52,25.83 47.52,22.12 LCD.5
N$12
  Top 0.254: JP2.2 R3.1
N$14
  Top 0.254: R3.2 35.98,12.99 LS1.+
N$15  (via drill 0.35)
  Top 0.254: v33.02,33.02 33.42,33.42 U2.28
  Bottom 0.254: v33.02,33.02 33.02,33.84 30.03,36.83 29.21,36.83 ICSP.3
N$16
  Top 0.254: C3.1 42.31,38.92 U2.20
N$17
  Top 0.254: C11.1 19.93,25.36 U1.17
N$24
  Top 0.254: J4.D- 16.95,25.85 18.93,25.85 19.29,26.21 U1.16
N$30
  Top 0.152: J4.VBUS 14.89,25.4 17.78,25.4 17.78,21.59 | L2.1 17.78,21.59 | C10.1 17.78,21.59
N$32
  Top 0.254: R2.1 4.66,16.93 TXLED.A
N$33
  Top 0.254: R1.1 12.28,16.93 RXLED.A
POTIN
  Top 0.254: U2.26 36.35,35.02 32,39.37 29.21,39.37 ICSP.4
  Bottom 0.254: JP1.6 ICSP.4
RESET  (via drill 0.35)
  Top 0.254: v41.91,33.02 41.51,32.62 U2.29 | R11.1 40.22,45.3 S1.4 | C4.1 32.17,27.94 v36.83,27.94
  Bottom 0.254: S1.3 S1.4 | v36.83,27.94 39.37,27.94 41.91,30.48 v41.91,33.02 41.91,37.11 S1.3 | S1.3 37.26,38.1 ICSP.5
RXD  (via drill 0.35)
  Top 0.254: U1.5 24.68,34.33 24.68,34.95 24.84,35.11 27.38,35.11 27.77,34.72 30.05,34.72 v31.75,33.02 | v34.29,31.24 34.51,31.02 U2.31
  Bottom 0.254: v31.75,33.02 33.53,31.24 v34.29,31.24
RXLED
  Top 0.254: U1.22 23.18,28.89 22.15,29.92 13.31,29.92 11.77,28.38 11.77,23.79 15.24,20.32 R1.2
TXD
  Top 0.254: U1.1 29.81,34.14 32.13,31.82 U2.30
TXLED
  Top 0.254: U1.23 23.64,27.02 23.64,29.01 22.32,30.33 12.55,30.33 7.62,25.4 R2.2
VBUS
  Top 0.152: C12.1 C13.1
  Top 0.254: U1.20 21.89,25.55 23.16,24.28 23.16,24.13 | 23.16,24.13 23.16,22.01 | C13.1 24.13,18.2 24.13,22.01 23.16,22.01 | L2.2 21.59,22.01 23.16,22.01 | 23.16,24.13 24.87,25.85 27.38,25.85 27.54,26.01 27.54,27.64 25.14,30.04 U1.4
VIN
  Top 0.61: C7.2 D1.C IC1.IN 24.13,10.16 C5.1

### Text on the board
tNames: ece-411-t3-All_In_One_Dice | Devon Mickels / Jack Chen / Nicole Fellows / Hannah Mortimer